# EAGLE schematic TMP117 (EAGLE 7.5.0)
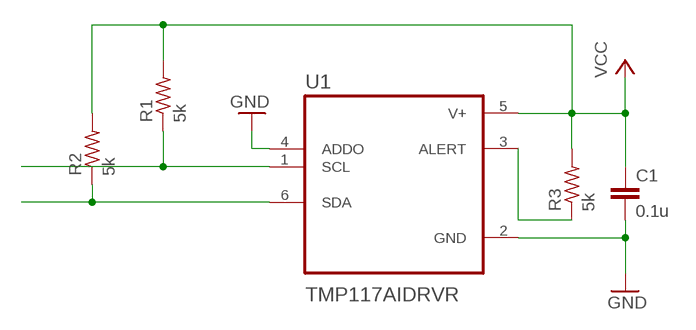
[diagram p0: schematic, sheet 1]

## Parts
C1  0.1u  C-EUC0402  [C0402]
R1  5k  R-US_R0402  [R0402]
R2  5k  R-US_R0402  [R0402]
R3  5k  R-US_R0402  [R0402]
U1  TMP117AIDRVR  [SON65P200X200X80-7N]

## Nets
GND: C1.2 U1.2(GND) U1.4(ADDO)
N$2: R1.1 U1.1(SCL)
N$3: R2.1 U1.6(SDA)
N$5: R3.1 U1.3(ALERT)
VCC: C1.1 R1.2 R2.2 R3.2 U1.5(V+)

## Library data of the parts
C1 = rcl:C-EU: CAPACITOR, European symbol
R1-R3 = rcl:R-US_: RESISTOR, American symbol
U1 = TMP117AIDRVR:TMP117AIDRVR; DESCRIPTION: 0.1C accurate digital temperature sensor with integrated NV memory 6-WSON -55 to 150; DIGI-KEY_PART_NUMBER: 296-51834-1-ND; MF: Texas Instruments; MP: TMP117AIDRVR; PACKAGE: WSON-6 Texas Instruments; PURCHASE-URL: https://pricing.snapeda.com/search/part/TMP117AIDRVR/?ref=eda